# EasyEDA Pro project 3轴5.2_ -0718 -(8.8x13cm).eprj, schematic 3轴5.2-原理图

## Sheets
1 主控: Board Name: 3轴5.2--V3.4; Create Date: 2025-02-21; Page Name: 主控; Project Name: 3轴5.2_改丝印; Schematic Name: 3轴5.2-原理图; Update Date: 2025-02-28; Address1: *; Address2: *; Address3: *; Address4: *; Application_BuildNumber: *; ApprovedBy: *; Author: *; CheckedBy: *; CompanyName: *; CurrentDate: *; CurrentTime: *; Date: *; DocumentFullPathAndName: *; DocumentName: *; DocumentNumber: *; DrawnBy: *; Engineer: *; ImagePath: *; ModifiedDate: *; Organization: *; ProjectName: *; Revision: *; Rule: *; SheetNumber: *; SheetTotal: *; Time: *; Title: *
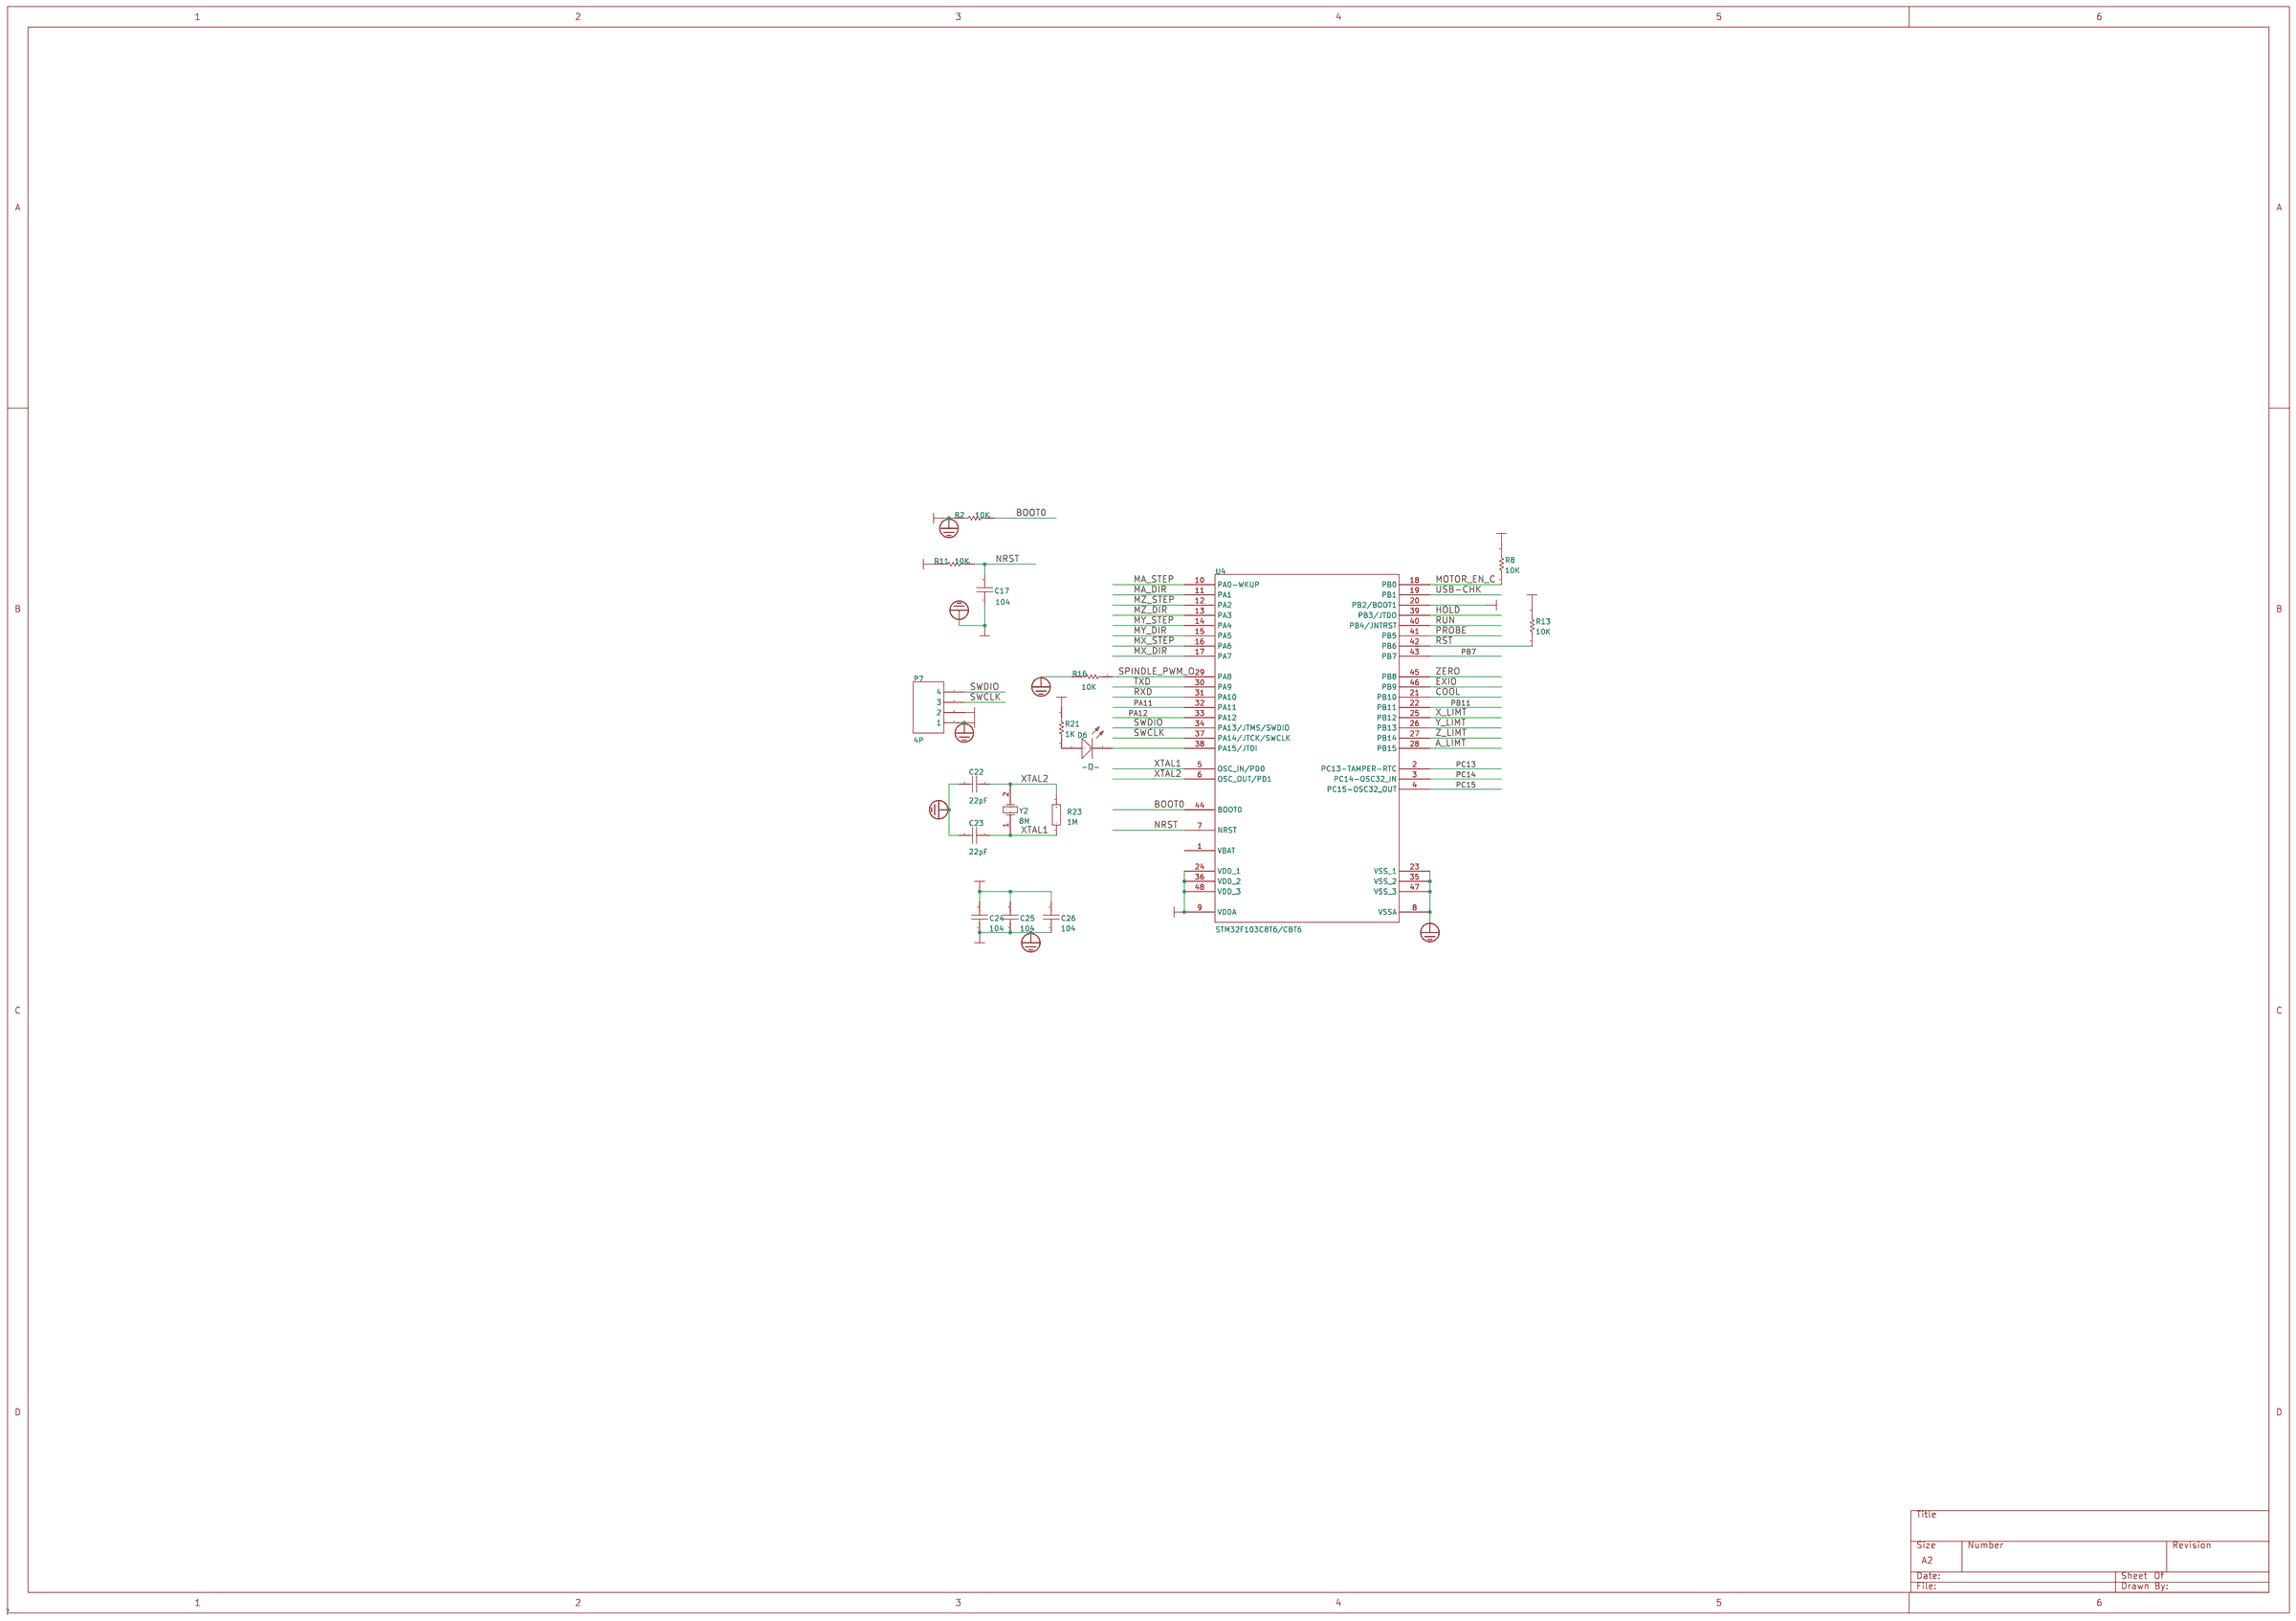
[diagram p0: 主控]
2 电源部分: Board Name: 3轴5.2-原理图-V3.2; Page Name: 电源部分; Project Name: 3轴5.2+D; Schematic Name: 3轴5.2-原理图-V3.2; Update Date: 2025-02-21
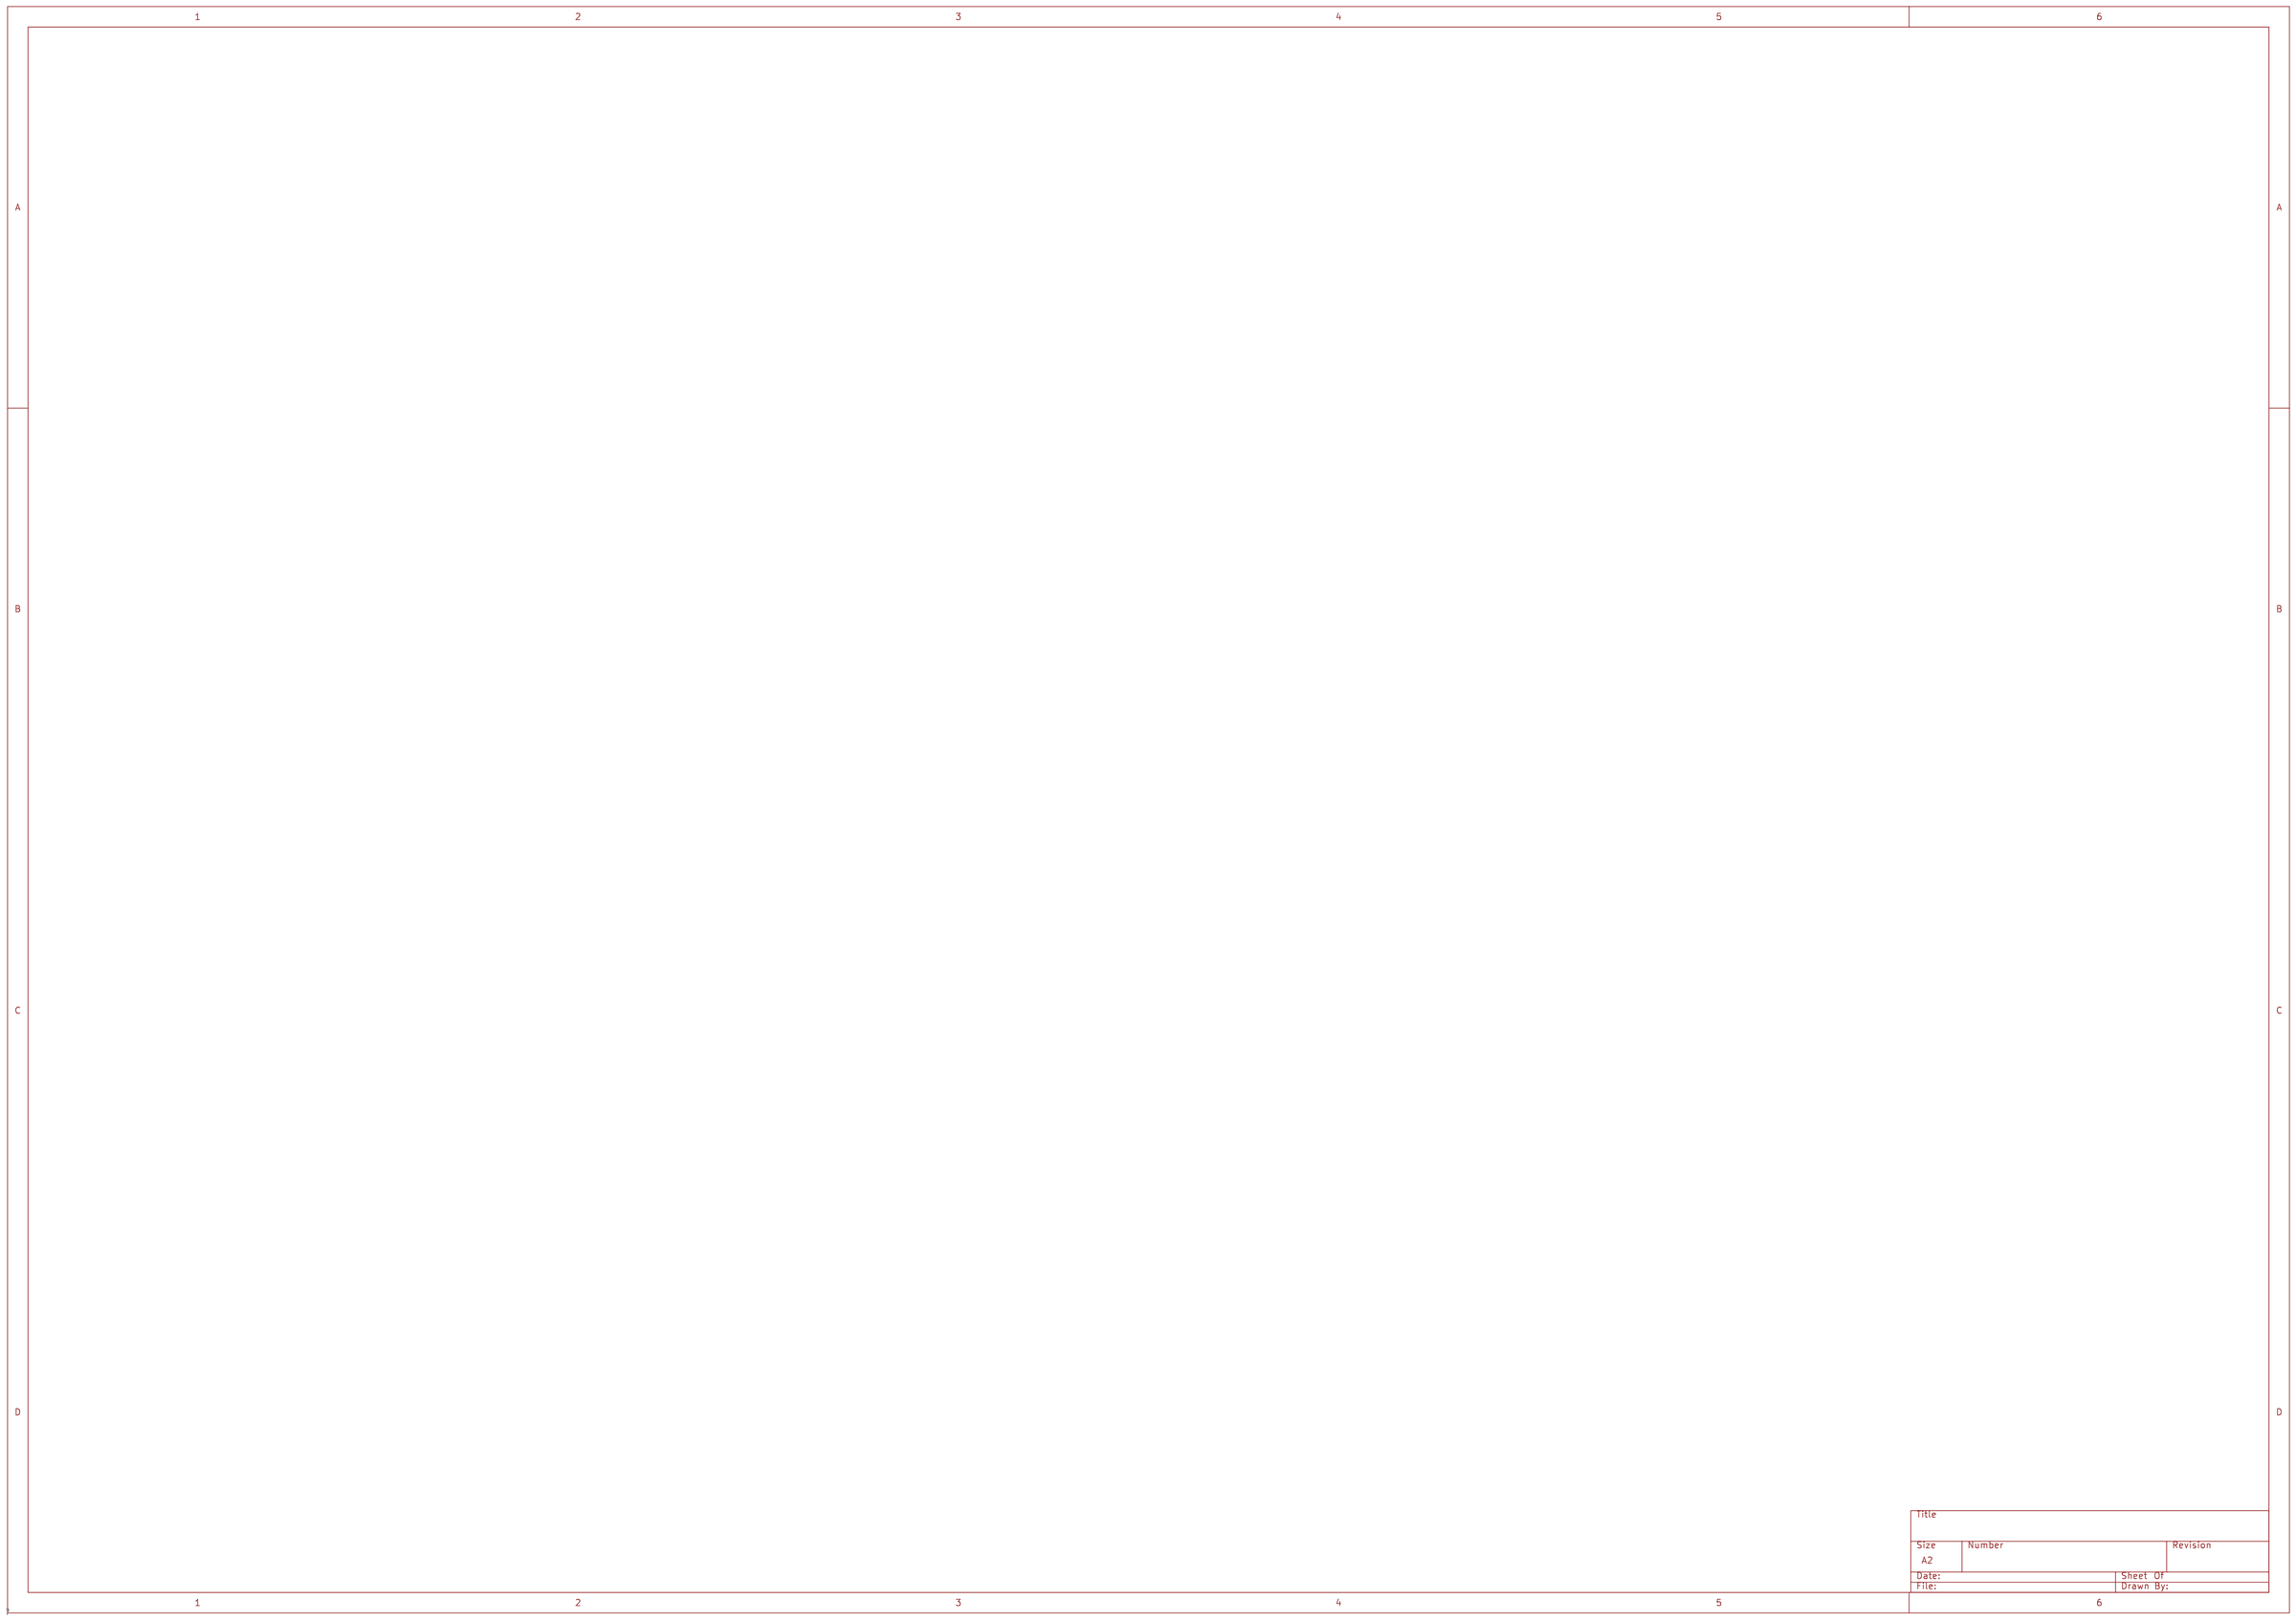
[diagram p1: 电源部分]

## Parts
C17  104  [C0603]
C22  100pF  [C0603]
C23  100pF  [C0603]
C24  104  [C0603]
C25  104  [C0603]
C26  104  [C0603]
D6  -̹-  [0603LED]
P7  4P  [SIP4]
R2  10K  [0603R]
R8  10K  [0603R]
R11  10K  [0603R]
R13  10K  [0603R]
R16  10K  [0603R]
R21  1K  [0603R]
R23  1M  [R0603]
U4  STM32F103C8T6/CBT6  [LQFP48]
Y2  8M  [晶振贴片]

## Library data of the parts
C17 = 104: Capacitor (Semiconductor SIM Model); Published: 8-Jun-2000; LatestRevisionDate: 17-Jul-2002; LatestRevisionNote: Re-released for DXP Platform.; PackageReference: C1206; Publisher: Altium Limited; Origin Footprint 2: C1206; Origin Footprint 3: 0402; Origin Footprint 4: 1310[0504]; Origin Footprint 5: 1608[0603]; Origin Footprint 6: C1210; Origin Footprint 7: C0805; Origin Footprint 8: C1206; Origin Footprint 9: 0805; Origin Footprint 10: 0805L; Origin Footprint 1: 0603C; Design Item ID: Cap Semi; Library Name: Miscellaneous Devices; Origin Footprint 11: 0805C
C22 C23 = 22pF: Capacitor (Semiconductor SIM Model); Published: 8-Jun-2000; LatestRevisionDate: 17-Jul-2002; LatestRevisionNote: Re-released for DXP Platform.; PackageReference: C1206; Publisher: Altium Limited; Origin Footprint 2: C1206; Origin Footprint 3: 0402; Origin Footprint 4: 1310[0504]; Origin Footprint 5: 1608[0603]; Origin Footprint 6: C1210; Origin Footprint 7: C0805; Origin Footprint 8: C1206; Origin Footprint 9: 0805; Origin Footprint 10: 0805L; Origin Footprint 11: 0805C; Origin Footprint 1: 0603C; Design Item ID: Cap Semi; Library Name: Miscellaneous Devices
C24-C26 = 104: Origin Footprint 1: 0603C; Design Item ID: CAP; Library Name: SCH--װ--; Origin Footprint 2: CAP; Origin Footprint 3: 0805C
D6 = �̹�: Origin Footprint 2: LED(С); Design Item ID: LED; Library Name: SCH--װ--
P7 = 4P: Library Name: SCH--װ--
R2 R11 R16 = 10K: Resistor; Published: 8-Jun-2000; LatestRevisionDate: 17-Jul-2002; LatestRevisionNote: Re-released for DXP Platform.; PackageReference: AXIAL-0.3; Publisher: Altium Limited; Origin Footprint 2: AXIAL-0.3; Origin Footprint 3: 0805R; Origin Footprint 4: 0805R; Design Item ID: RES; Library Name: SCH--װ--
R8 = RES: Resistor; Published: 8-Jun-2000; LatestRevisionDate: 17-Jul-2002; LatestRevisionNote: Re-released for DXP Platform.; PackageReference: AXIAL-0.3; Publisher: Altium Limited; Origin Footprint 2: AXIAL-0.3; Origin Footprint 3: 0805R; Library Name: SCH--װ--
R13 = 10K: Resistor; Published: 8-Jun-2000; LatestRevisionDate: 17-Jul-2002; LatestRevisionNote: Re-released for DXP Platform.; PackageReference: AXIAL-0.3; Publisher: Altium Limited; Origin Footprint 2: AXIAL-0.3; Origin Footprint 3: R0805; Origin Footprint 4: 0805R; Design Item ID: RES; Library Name: SCH--װ--
R21 = 1K: Resistor; Published: 8-Jun-2000; LatestRevisionDate: 17-Jul-2002; LatestRevisionNote: Re-released for DXP Platform.; PackageReference: AXIAL-0.3; Publisher: Altium Limited; Origin Footprint 2: AXIAL-0.3; Origin Footprint 3: R0805; Origin Footprint 4: 0805R; Design Item ID: RES; Library Name: SCH--װ--
R23 = Res_0603: Supplier Footprint: 0603
U4 = STM32F103C8T6/CBT6: STM32 ARM-based 32-bit MCU with 32 Kbytes Flash, 48-pin LQFP, Industrial Temperature; Published: *; DatasheetVersion: *; PackageVersion: *; PackageReference: *; Publisher: *; PackageDescription: *; ComponentLink1Description: *; ComponentLink1URL: *; ComponentLink2Description: *; ComponentLink2URL: *; Origin Footprint 2: LQFP48_L; Origin Footprint 3: LQFP48_M; Design Item ID: STM32F103C6T6; Library Name: ST Microcontroller 32-Bit STM32 SCH
Y2 = 8M: Crystal Oscillator; Published: 8-Jun-2000; LatestRevisionDate: 17-Jul-2002; LatestRevisionNote: Re-released for DXP Platform.; PackageReference: R38; Publisher: Altium Limited; Origin Footprint 2: R38; Origin Footprint 3: XTAL-49S; Origin Footprint 1: ______Ƭ; Design Item ID: XTAL; Library Name: Miscellaneous Devices

## Nets
3V3: C24.2 C25.2 C26.2 P7.2 R8.2 R11.1 R13.1 R21.2 U4.9(VDDA) U4.24(VDD_1) U4.36(VDD_2) U4.48(VDD_3)
PGND: C17.1 C22.2 C23.2 C24.1 C25.1 C26.1 P7.1 R2.1 R16.1 U4.8(VSSA) U4.20(PB2/BOOT1) U4.23(VSS_1) U4.35(VSS_2) U4.47(VSS_3)
A_LIMT: U4.28(PB15)
BOOT0: R2.2 U4.44(BOOT0)
COOL: U4.21(PB10)
EXIO: U4.46(PB9)
HOLD: U4.39(PB3/JTDO)
MA_DIR: U4.11(PA1)
MA_STEP: U4.10(PA0-WKUP)
MOTOR_EN_C: R8.1 U4.18(PB0)
MX_DIR: U4.17(PA7)
MX_STEP: U4.16(PA6)
MY_DIR: U4.15(PA5)
MY_STEP: U4.14(PA4)
MZ_DIR: U4.13(PA3)
MZ_STEP: U4.12(PA2)
NRST: C17.2 R11.2 U4.7(NRST)
PA11: U4.32(PA11)
PA12: U4.33(PA12)
PB7: U4.43(PB7)
PB11: U4.22(PB11)
PC13: U4.2(PC13-TAMPER-RTC)
PC14: U4.3(PC14-OSC32_IN)
PC15: U4.4(PC15-OSC32_OUT)
PROBE: U4.41(PB5)
RST: R13.2 U4.42(PB6)
RUN: U4.40(PB4/JNTRST)
RXD: U4.31(PA10)
SPINDLE_PWM_O: R16.2 U4.29(PA8)
SWCLK: P7.3 U4.37(PA14/JTCK/SWCLK)
SWDIO: P7.4 U4.34(PA13/JTMS/SWDIO)
TXD: U4.30(PA9)
USB-CHK: U4.19(PB1)
X_LIMT: U4.25(PB12)
XTAL1: C23.1 R23.1 U4.5(OSC_IN/PD0) Y2.1(OSC1)
XTAL2: C22.1 R23.2 U4.6(OSC_OUT/PD1) Y2.2(OSC2)
Y_LIMT: U4.26(PB13)
Z_LIMT: U4.27(PB14)
ZERO: U4.45(PB8)
Net-(D6-1): D6.1 R21.1
Net-(D6-2): D6.2 U4.38(PA15/JTDI)

Not connected (* = marked no-connect by the designer): U4 1(VBAT)
